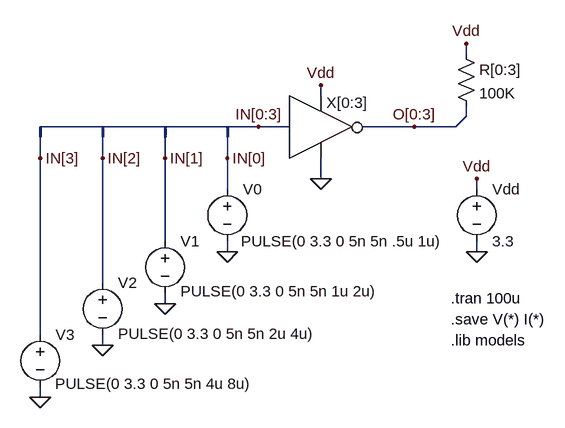
[diagram p0: schematic bus.asc]
bus.asc, the LTspice schematic file:
Version 4
SHEET 1 960 680
WIRE -432 240 -432 208
WIRE -432 512 -432 240
WIRE -432 608 -432 592
WIRE -336 192 -432 192
WIRE -336 240 -336 208
WIRE -336 432 -336 240
WIRE -336 528 -336 512
WIRE -240 192 -336 192
WIRE -240 240 -240 208
WIRE -240 368 -240 240
WIRE -240 464 -240 448
WIRE -144 192 -240 192
WIRE -144 240 -144 208
WIRE -144 288 -144 240
WIRE -144 384 -144 368
WIRE -96 192 -144 192
WIRE -48 192 -96 192
WIRE 0 144 0 128
WIRE 0 272 0 240
WIRE 144 192 64 192
WIRE 208 192 144 192
WIRE 224 80 224 64
WIRE 224 176 208 192
WIRE 224 176 224 160
WIRE 240 288 240 272
WIRE 240 384 240 368
FLAG -432 608 0
FLAG 240 384 0
FLAG 0 272 0
FLAG 0 128 Vdd
FLAG 240 272 Vdd
FLAG 224 64 Vdd
FLAG 144 192 O[0:3]
FLAG -96 192 IN[0:3]
FLAG -336 528 0
FLAG -240 464 0
FLAG -144 384 0
FLAG -144 240 IN[0]
FLAG -240 240 IN[1]
FLAG -336 240 IN[2]
FLAG -432 240 IN[3]
BUSTAP -432 192 -432 208
BUSTAP -336 192 -336 208
BUSTAP -240 192 -240 208
BUSTAP -144 192 -144 208
SYMBOL voltage -432 496 R0
WINDOW 123 0 0 Left 0
WINDOW 39 0 0 Left 0
WINDOW 3 23 91 Left 0
SYMATTR Value PULSE(0 3.3 0 5n 5n 4u 8u)
SYMATTR InstName V3
SYMBOL voltage 240 272 R0
SYMATTR InstName Vdd
SYMATTR Value 3.3
SYMBOL inverter 0 192 R0
WINDOW 0 9 -37 Left 0
SYMATTR InstName X[0:3]
SYMBOL res 208 64 R0
SYMATTR InstName R[0:3]
SYMATTR Value 100K
SYMBOL voltage -336 416 R0
WINDOW 123 0 0 Left 0
WINDOW 39 0 0 Left 0
WINDOW 3 24 94 Left 0
SYMATTR Value PULSE(0 3.3 0 5n 5n 2u 4u)
SYMATTR InstName V2
SYMBOL voltage -240 352 R0
WINDOW 123 0 0 Left 0
WINDOW 39 0 0 Left 0
WINDOW 3 24 93 Left 0
SYMATTR Value PULSE(0 3.3 0 5n 5n 1u 2u)
SYMATTR InstName V1
SYMBOL voltage -144 272 R0
WINDOW 3 21 96 Left 0
SYMATTR Value PULSE(0 3.3 0 5n 5n .5u 1u)
SYMATTR InstName V0
TEXT 200 456 Left 0 !.tran 100u
TEXT 200 520 Left 0 !.lib models
TEXT 200 488 Left 0 !.save V(*) I(*)

The netlist it stands for:
* bus.asc
V3 IN[3] 0 PULSE(0 3.3 0 5n 5n 4u 8u)
Vdd Vdd 0 3.3
XX[0:3] IN[0:3] O[0:3] Vdd 0 inverter  ; pins IN _OUT Vdd GND
R[0:3] Vdd O[0:3] 100K
V2 IN[2] 0 PULSE(0 3.3 0 5n 5n 2u 4u)
V1 IN[1] 0 PULSE(0 3.3 0 5n 5n 1u 2u)
V0 IN[0] 0 PULSE(0 3.3 0 5n 5n .5u 1u)
.tran 100u
.lib models
.save V(*) I(*)
.backanno
.end